# EAGLE design Board1_V3_singleSIded (EAGLE 7.2.0)
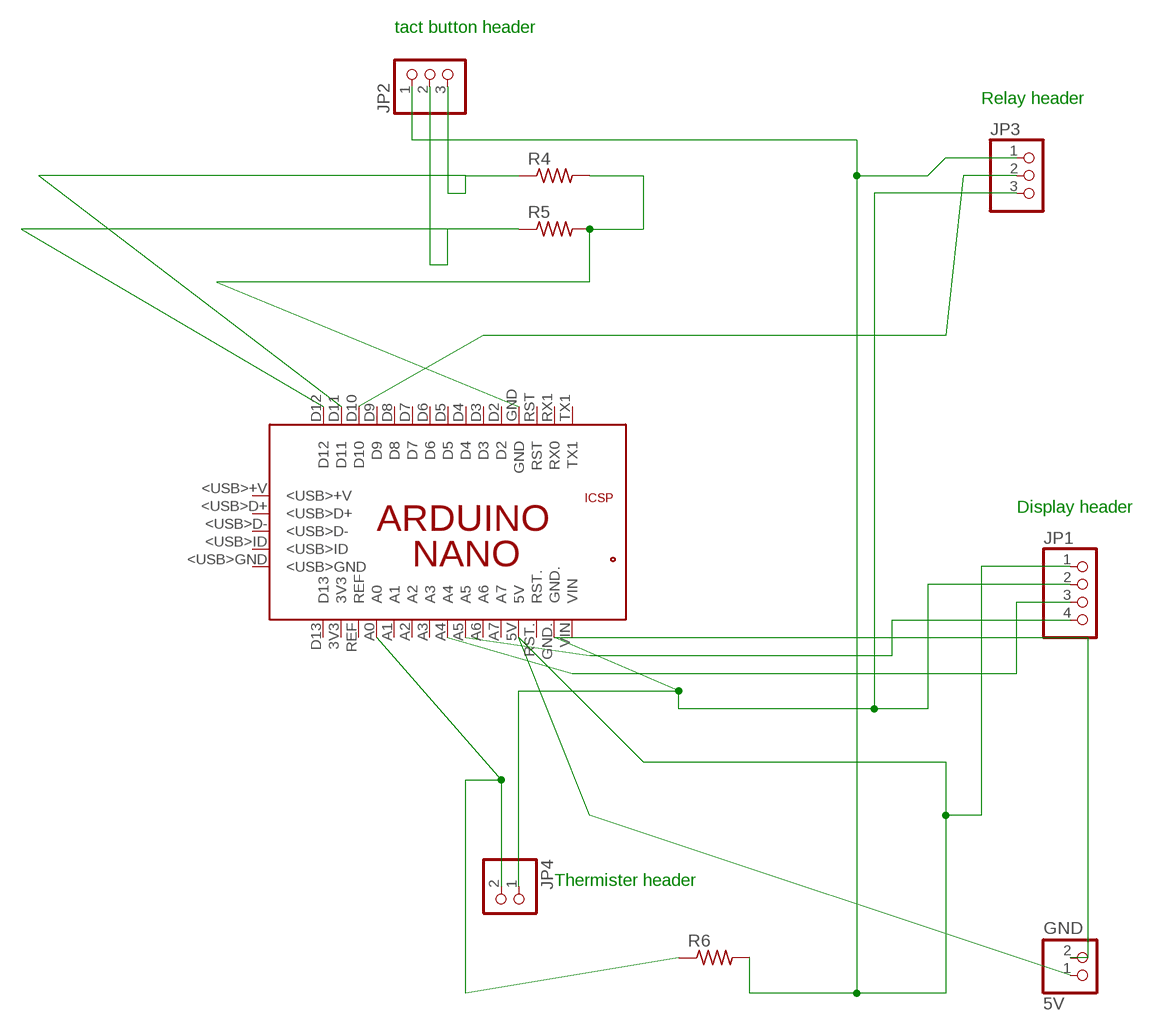
[diagram p0: schematic, sheet 1]

## Parts
5V  GND  PINHD-1X2/90  [1X02/90]
JP1  PINHD-1X4/90  [1X04/90]
JP2  PINHD-1X3/90  [1X03/90]
JP3  PINHD-1X3/90  [1X03/90]
JP4  PINHD-1X2/90  [1X02/90]
PCB1  ARDUINO_NANO  [ARDUINO_NANO]
R4  R-US_0207/10  [0207/10]
R5  R-US_0207/10  [0207/10]
R6  R-US_0207/15  [0207/15]

## Nets
N$1: JP2.2 PCB1.D12 R5.1
N$2: JP4.2 PCB1.A0 R6.1
N$3: JP3.2 PCB1.D10
N$18: 5V.2 JP1.2 JP3.3 JP4.1 PCB1.GND.
N$19: JP1.4 PCB1.A5
N$20: JP1.3 PCB1.A4
N$24: 5V.1 JP1.1 JP2.1 JP3.1 PCB1.5V R6.2
N$44: PCB1.GND R4.2 R5.2
N$45: JP2.3 PCB1.D11 R4.1
Unconnected: PCB1.3V3 PCB1.5V. PCB1.<USB>+V PCB1.<USB>D+ PCB1.<USB>D- PCB1.<USB>GND PCB1.<USB>ID PCB1.A1 PCB1.A2 PCB1.A3 PCB1.A6 PCB1.A7 PCB1.D2 PCB1.D3 PCB1.D4 PCB1.D5 PCB1.D6 PCB1.D7 PCB1.D8 PCB1.D9 PCB1.D13 PCB1.GND_ PCB1.MISO PCB1.MOSI PCB1.REF PCB1.RESET.. PCB1.RST PCB1.RST. PCB1.RX1(RX0) PCB1.SCK PCB1.TX1 PCB1.VIN

## Notes on the sheet
- tact button header
- Relay header
- Display header
- Thermister header

## Library data of the parts
5V JP4 = pinhead:PINHD-1X2: PIN HEADER
JP1 = pinhead:PINHD-1X4: PIN HEADER
JP2 JP3 = pinhead:PINHD-1X3: PIN HEADER
PCB1 = E14_Arduino_revB:ARDUINO_NANO: Device for representing an Arduino Nano board with a footprint in an EAGLE design. Created by Dave Young for Element14. More EAGLE documentation at: http://www.element14.com/community/community/knode/cadsoft_eagle
R4-R6 = resistor:R-US_: RESISTOR, American symbol

## Board
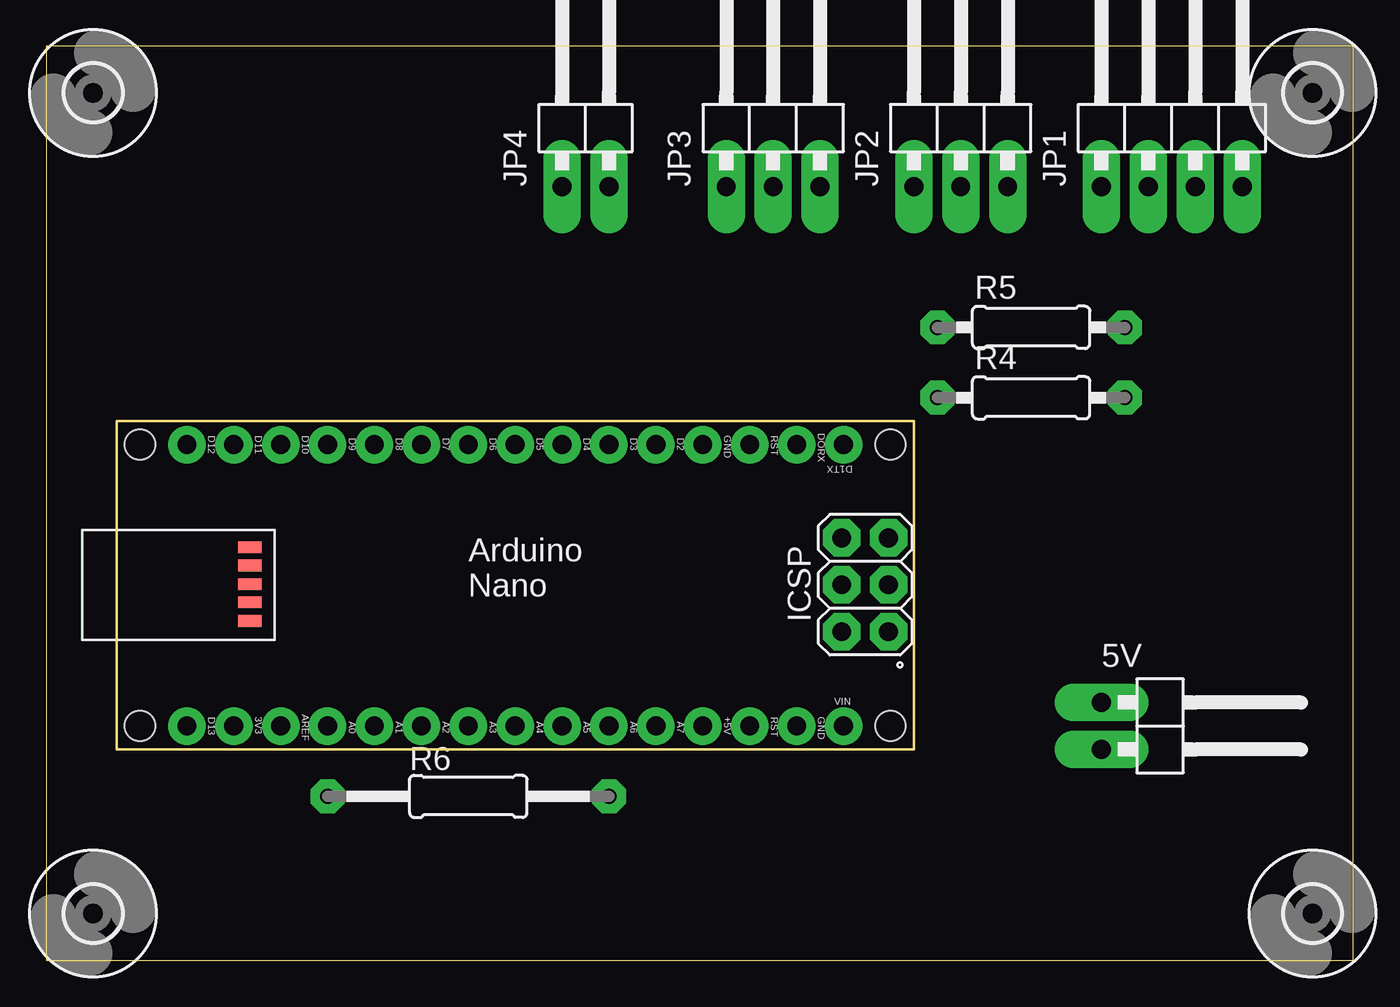
[diagram p1: board, top side]
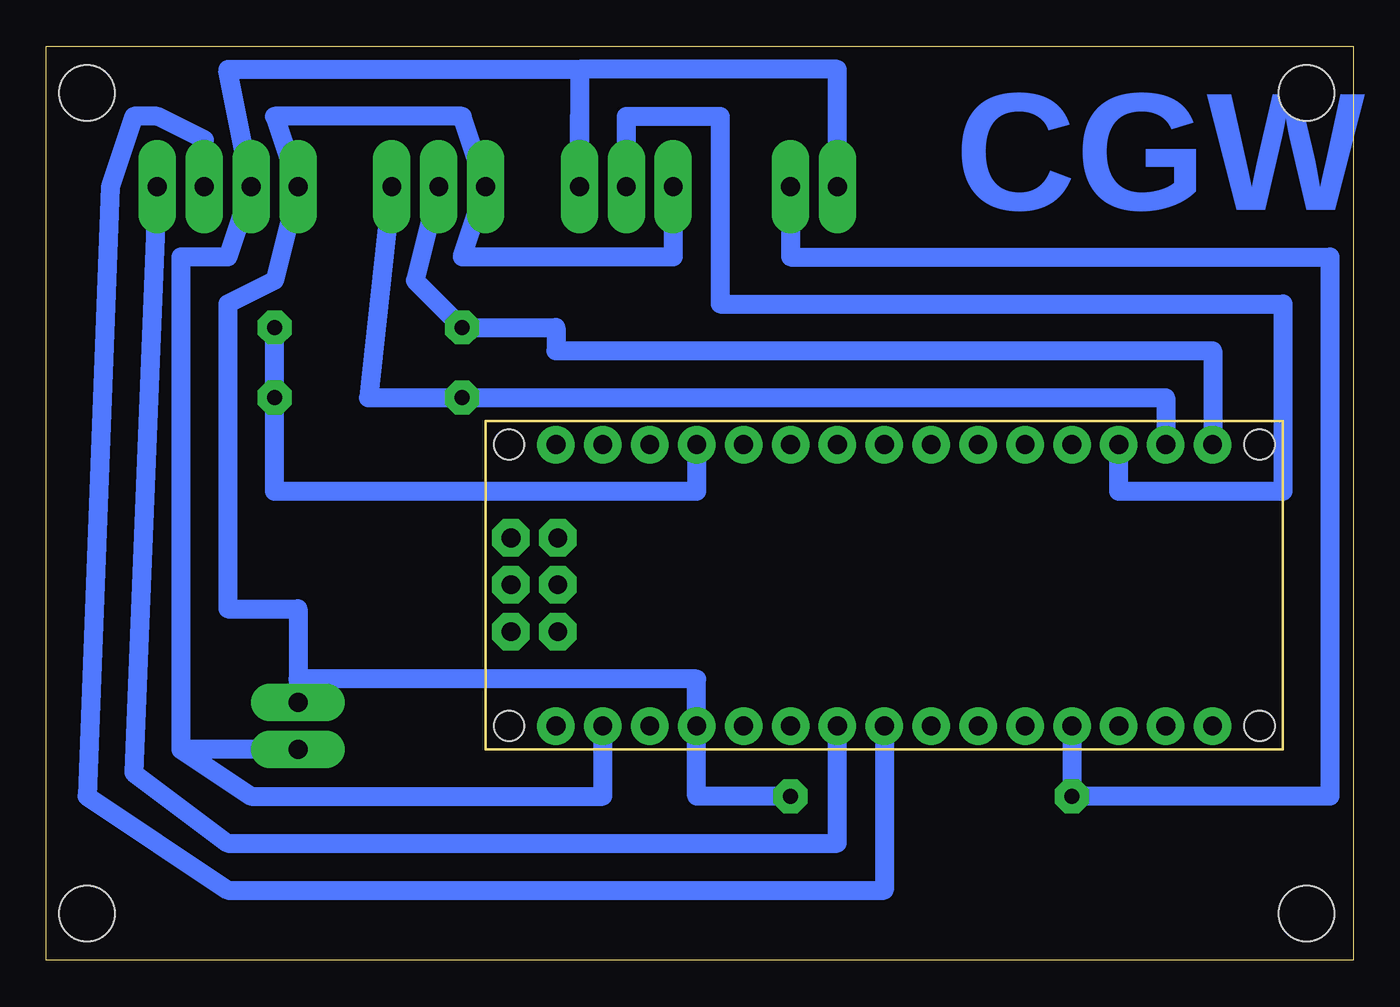
[diagram p2: board, bottom side, seen from below]

Size 70.79 x 49.52 mm. Coordinates in mm from the lower left corner, seen from the top.
Outline: 0,0 70.79,0 70.79,49.52 0,49.52 0,0
Copper layers (1*16): Top 0.035mm / dielectric 1.5mm / Bottom 0.035mm
Design rules "DesignRules_ShopBotBoard *": minimum track width 30mil, minimum drill 24mil, track to track 30mil, track to pad 30mil, pad to pad 30mil, via to via 30mil, smd to smd 15mil, copper to edge 40mil, drill to drill 30mil, minimum pad ring 20mil, minimum via ring 20mil, stop-mask expansion 4mil, vias tented up to drill 0mil, thermal gap 10mil

### Footprints (pad centres in the part's own frame; a part is rotated, then mirrored left to right if it is on the bottom)
1X02/90 = drill 1.016 long: 1 -1.27,-3.81; 2 1.27,-3.81
1X04/90 = drill 1.016 long: 1 -3.81,-3.81; 2 -1.27,-3.81; 3 1.27,-3.81; 4 3.81,-3.81
1X03/90 = drill 1.016 long: 1 -2.54,-3.81; 2 0,-3.81; 3 2.54,-3.81
ARDUINO_NANO = drill 1.016 pad 1.778: 3V3 6.35,1.27; 5V 31.75,1.27; A0 11.43,1.27; A1 13.97,1.27; A2 16.51,1.27; A3 19.05,1.27; A4 21.59,1.27; A5 24.13,1.27; A6 26.67,1.27; A7 29.21,1.27; D2 29.21,16.51; D3 26.67,16.51; D4 24.13,16.51; D5 21.59,16.51; D6 19.05,16.51; D7 16.51,16.51; D8 13.97,16.51; D9 11.43,16.51; D10 8.89,16.51; D11 6.35,16.51; D12 3.81,16.51; D13 3.81,1.27; GND 31.75,16.51; GND. 36.83,1.27; REF 8.89,1.27; RST 34.29,16.51; RST. 34.29,1.27; RX1 36.83,16.51; TX1 39.37,16.51; VIN 39.37,1.27 | drill 1.016 pad 1.778 octagon: 5V. 39.268,6.375; GND_ 39.268,11.455; MISO 41.808,6.375; MOSI 39.268,8.915; RESET.. 41.808,11.455; SCK 41.808,8.915 | smd 1.27 x 0.635: <USB>+V 7.214,10.947; <USB>D+ 7.214,9.957; <USB>D- 7.214,8.941; <USB>GND 7.214,6.96; <USB>ID 7.214,7.976 | hole 1.651: 1.27,1.27; 1.27,16.51; 41.91,16.51; 41.91,1.27
0207/10 = drill 0.813 octagon: 1 -5.08,0; 2 5.08,0
0207/15 = drill 0.813 octagon: 1 -7.62,0; 2 7.62,0
3,0 = hole 3: 0,0

### Placement (x,y rotation side)
5V  60.96,12.7 270 top
JP1  60.96,45.72 0 top
JP2  49.53,45.72 0 top
JP3  39.37,45.72 0 top
JP4  29.21,45.72 0 top
PCB1  3.81,11.43 0 top
R4  53.34,30.48 0 top
R5  53.34,34.29 0 top
R6  22.86,8.89 0 top
U$1  [3,0]  2.54,2.54 0 top
U$2  [3,0]  2.54,46.99 0 top
U$3  [3,0]  68.58,46.99 0 top
U$4  [3,0]  68.58,2.54 0 top

### Tracks (layer width: path | path; a pad name or v marks a point on that pad's centre or on a via)
N$1
  Bottom 1.016: PCB1.D12 7.62,33.02 43.18,33.02 43.18,34.29 R5.1 50.8,36.83 JP2.2
N$2
  Bottom 1.016: JP4.2 30.48,38.1 1.27,38.1 1.27,8.89 R6.1 PCB1.A0
N$3
  Bottom 1.016: JP3.2 39.37,45.72 34.29,45.72 34.29,35.56 3.81,35.56 3.81,25.4 12.7,25.4 PCB1.D10
N$18
  Bottom 1.016: 41.91,45.72 JP3.3 41.91,48.26 | PCB1.GND. 40.64,8.89 59.69,8.89 63.5,11.43 | 41.91,48.26 60.96,48.26 JP1.2 60.96,38.1 63.5,38.1 63.5,11.43 | JP4.1 27.94,48.26 41.91,48.26 | 5V.2 63.5,11.43
N$19
  Bottom 1.016: JP1.4 66.04,10.16 60.96,6.35 27.94,6.35 PCB1.A5
N$20
  Bottom 1.016: PCB1.A4 25.4,3.81 60.96,3.81 68.58,8.89 67.31,41.91 66.04,45.72 64.77,45.72 62.23,44.45 JP1.3
N$24
  Bottom 1.016: JP3.1 36.83,38.1 48.26,38.1 JP2.1 48.26,45.72 58.42,45.72 JP1.1 58.42,36.83 60.96,35.56 60.96,19.05 57.15,19.05 5V.1 57.15,15.24 35.56,15.24 PCB1.5V 35.56,8.89 R6.2
N$44
  Bottom 1.016: PCB1.GND 35.56,25.4 58.42,25.4 R4.2 R5.2
N$45
  Bottom 1.016: PCB1.D11 10.16,30.48 R4.1 53.34,30.48 JP2.3

### Text on the board
Bottom: CGW